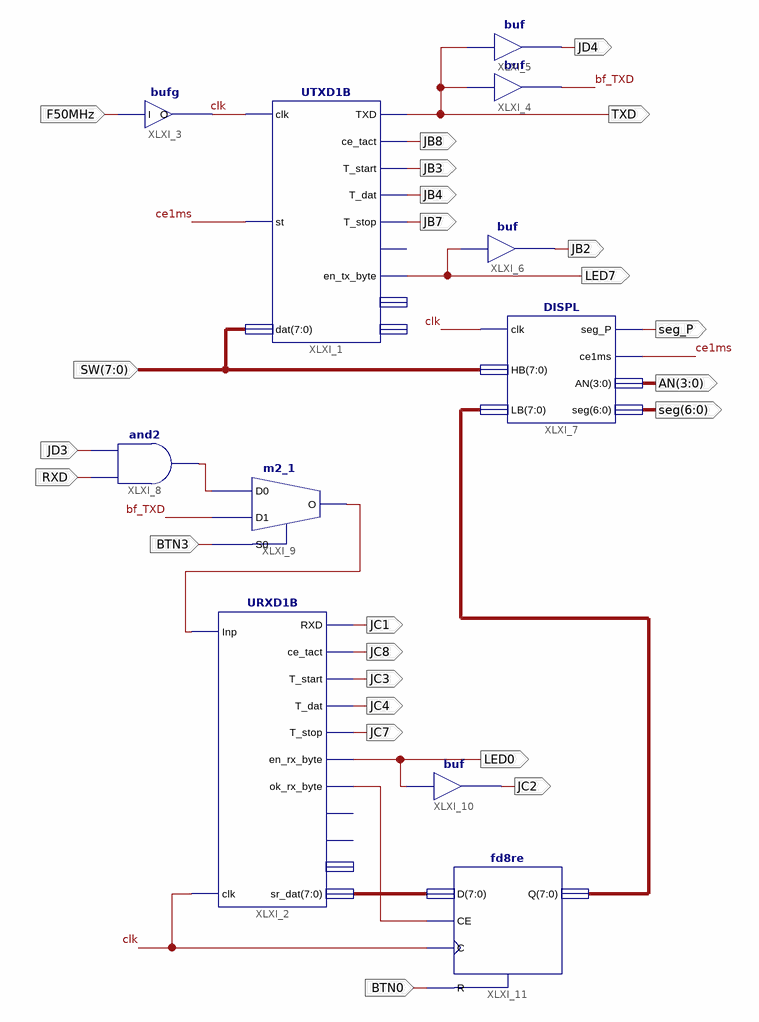
[diagram p0: schematic sheet 1]
// Xilinx ISE schematic Sch_LAB404.sch (spartan3e) as structural Verilog: 11 symbols, 24 ports
module Sch_LAB404 (
  input  F50MHz,
  input  [7:0] SW,
  input  JD3,
  input  RXD,
  input  BTN3,
  input  BTN0,
  output TXD,
  output JD4,
  output JB8,
  output JB3,
  output JB4,
  output JB7,
  output LED7,
  output JB2,
  output seg_P,
  output [6:0] seg,
  output [3:0] AN,
  output JC1,
  output JC8,
  output JC3,
  output JC4,
  output JC7,
  output LED0,
  output JC2
);

  wire bf_TXD, ce1ms, clk, XLXN_29, XLXN_33, XLXN_43;
  wire [7:0] XLXN_42, XLXN_46;

  UTXD1B XLXI_1 (
    .clk(clk), .st(ce1ms), .dat(SW), .TXD(TXD), .ce_tact(JB8), .T_start(JB3), .T_dat(JB4), .T_stop(JB7),
    .en_tx_byte(LED7));  // open: ce_stop, cb_bit, sr_dat
  buf XLXI_4 (bf_TXD, TXD);
  buf XLXI_5 (JD4, TXD);
  buf XLXI_6 (JB2, LED7);
  DISPL XLXI_7 (.clk(clk), .HB(SW), .LB(XLXN_46), .seg_P(seg_P), .ce1ms(ce1ms), .AN(AN), .seg(seg));
  m2_1 XLXI_9 (.D0(XLXN_29), .D1(bf_TXD), .S0(BTN3), .O(XLXN_33));
  bufg XLXI_3 (.I(F50MHz), .O(clk));
  URXD1B XLXI_2 (
    .RXD(JC1), .ce_tact(JC8), .T_start(JC3), .T_dat(JC4), .T_stop(JC7), .en_rx_byte(LED0),
    .ok_rx_byte(XLXN_43), .sr_dat(XLXN_42), .Inp(XLXN_33), .clk(clk));  // open: start, ce_bit, cb_bit
  and XLXI_8 (XLXN_29, RXD, JD3);
  buf XLXI_10 (JC2, LED0);
  fd8re XLXI_11 (.C(clk), .CE(XLXN_43), .D(XLXN_42), .R(BTN0), .Q(XLXN_46));
endmodule
